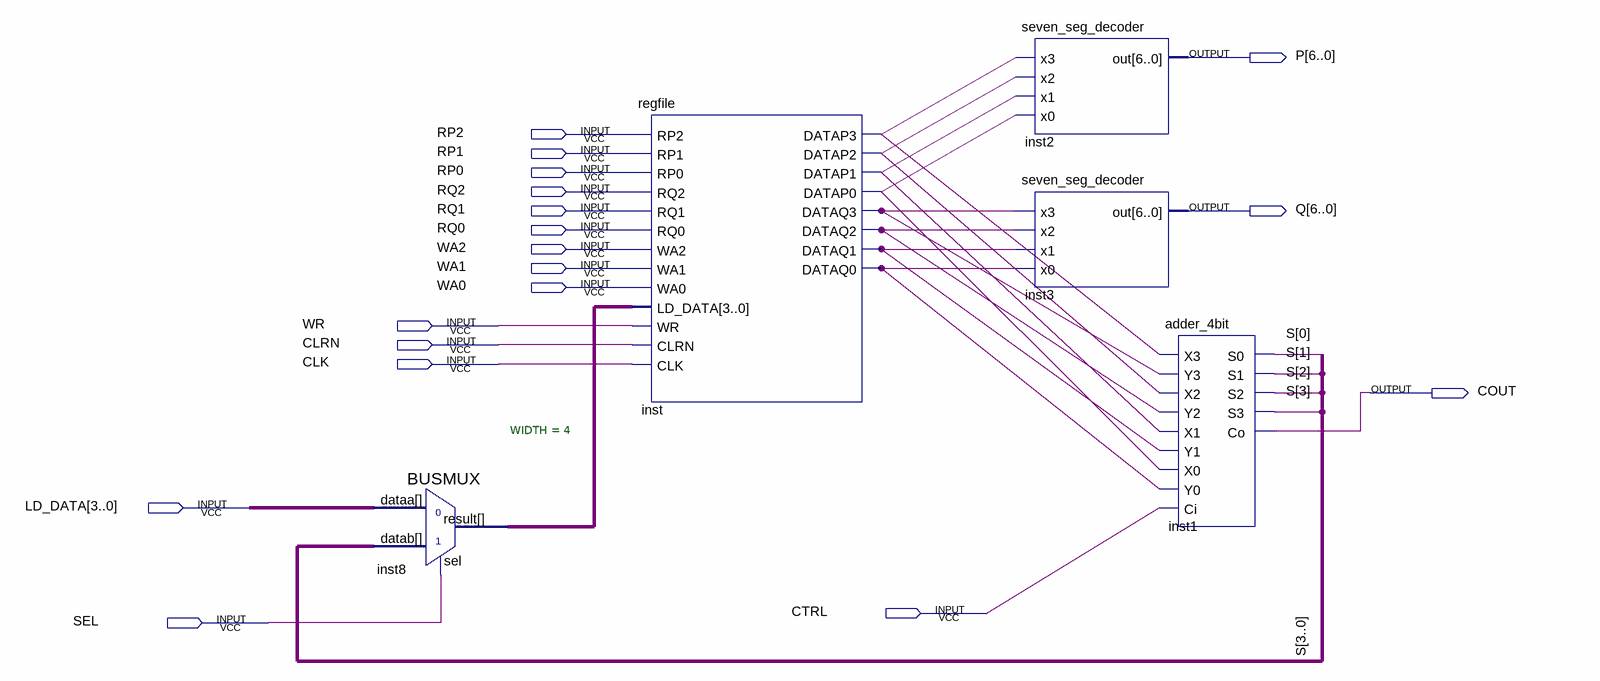
[diagram p0: schematic sheet]
// Quartus schematic Final.bdf as structural Verilog: 5 symbols, 18 pins
module Final (
  input  RP2,
  input  RP1,
  input  RP0,
  input  RQ2,
  input  RQ1,
  input  RQ0,
  input  WA2,
  input  WA1,
  input  WA0,
  input  WR,
  input  CLRN,
  input  CLK,
  input  [3:0] LD_DATA,
  input  CTRL,
  input  SEL,
  output [6:0] P,
  output [6:0] Q,
  output COUT
);

  wire inst_datap0, inst_datap1, inst_datap2, inst_datap3, inst_dataq0, inst_dataq1, inst_dataq2, inst_dataq3;
  wire [3:0] inst8_result, S;

  BUSMUX #(.WIDTH(4)) inst8 (.datab(S), .sel(SEL), .dataa(LD_DATA), .result(inst8_result));
  regfile inst (
    .RP2(RP2), .RP1(RP1), .RP0(RP0), .RQ2(RQ2), .RQ1(RQ1), .RQ0(RQ0), .WA2(WA2), .WA1(WA1), .WA0(WA0),
    .LD_DATA(inst8_result), .WR(WR), .CLRN(CLRN), .CLK(CLK), .DATAP3(inst_datap3), .DATAP2(inst_datap2),
    .DATAP1(inst_datap1), .DATAP0(inst_datap0), .DATAQ3(inst_dataq3), .DATAQ2(inst_dataq2),
    .DATAQ1(inst_dataq1), .DATAQ0(inst_dataq0));
  seven_seg_decoder inst2 (.x3(inst_datap3), .x2(inst_datap2), .x1(inst_datap1), .x0(inst_datap0), .out(P));
  seven_seg_decoder inst3 (.x3(inst_dataq3), .x2(inst_dataq2), .x1(inst_dataq1), .x0(inst_dataq0), .out(Q));
  adder_4bit inst1 (
    .X3(inst_datap3), .Y3(inst_dataq3), .X2(inst_datap2), .Y2(inst_dataq2), .X1(inst_datap1),
    .Y1(inst_dataq1), .X0(inst_datap0), .Y0(inst_dataq0), .Ci(CTRL), .S0(S[0]), .S1(S[1]), .S2(S[2]),
    .S3(S[3]), .Co(COUT));
endmodule
